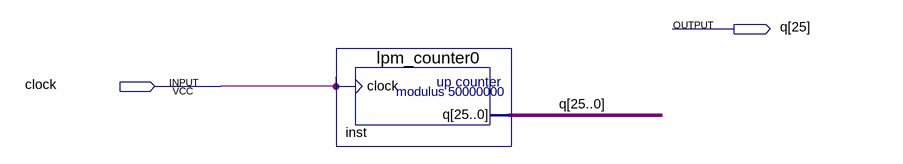
[diagram p0: schematic sheet]
// Quartus schematic testBDF.bdf as structural Verilog: 1 symbols, 2 pins
module testBDF (
  input  clock,
  output [25:0] q
);

  lpm_counter0 inst (.clock(clock), .q(q));
endmodule
